# Altium project Põhiplaat.PrjPcb
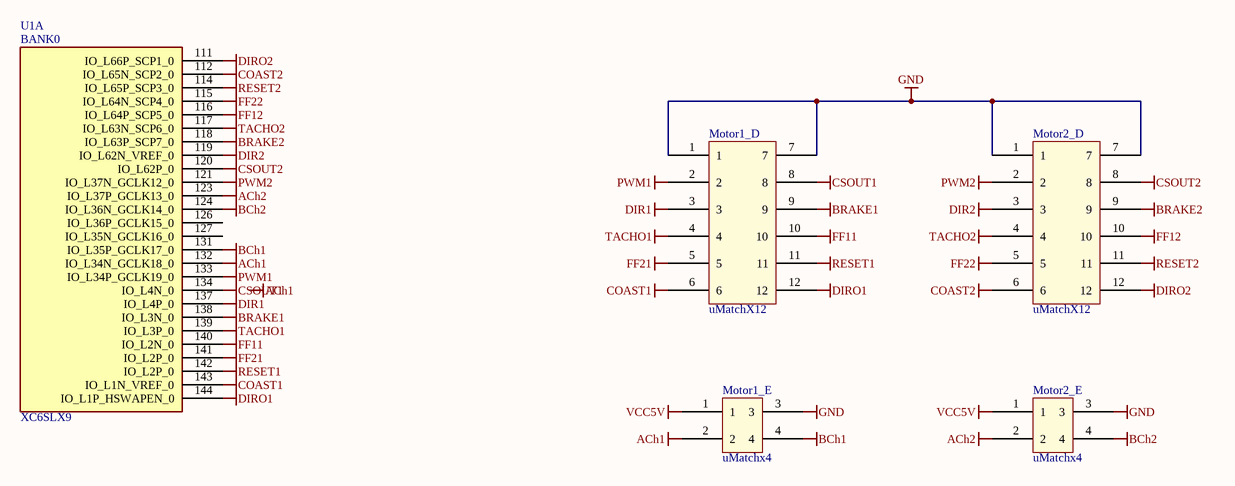
[diagram p0: BANK0.SchDoc]
5 sheets, 69 parts. Net scope: global (net labels, ports and power ports of the same name join across sheets).
Board file: Pohiplaat.PcbDoc
Sheets:
  BANK0.SchDoc
  BANK1.SchDoc
  BANK2.SchDoc
  BANK3.SchDoc
  Power.SchDoc

## Sheet BANK0.SchDoc
size A4

### Parts
Motor1_D  uMatchX12  [uMatchX12]
Motor1_E  uMatchx4  [Micromatch x4]
Motor2_D  uMatchX12  [uMatchX12]
Motor2_E  uMatchx4  [Micromatch x4]
U1  XC6SLX9  [XC6SLX9]  (part A of 6)

### Nets
ACh1: Motor1_E.2 U1.132(IO_L34N_GCLK18_0)
ACh2: Motor2_E.2 U1.123(IO_L37P_GCLK13_0)
BCh1: Motor1_E.4 U1.131(IO_L35P_GCLK17_0)
BCh2: Motor2_E.4 U1.124(IO_L36N_GCLK14_0)
BRAKE1: Motor1_D.9 U1.138(IO_L3N_0)
BRAKE2: Motor2_D.9 U1.118(IO_L63P_SCP7_0)
COAST1: Motor1_D.6 U1.143(IO_L1N_VREF_0)
COAST2: Motor2_D.6 U1.112(IO_L65N_SCP2_0)
CSOUT1: Motor1_D.8 U1.134(IO_L4N_0)
CSOUT2: Motor2_D.8 U1.120(IO_L62P_0)
DIR1: Motor1_D.3 U1.137(IO_L4P_0)
DIR2: Motor2_D.3 U1.119(IO_L62N_VREF_0)
DIRO1: Motor1_D.12 U1.144(IO_L1P_HSWAPEN_0)
DIRO2: Motor2_D.12 U1.111(IO_L66P_SCP1_0)
FF11: Motor1_D.10 U1.140(IO_L2N_0)
FF12: Motor2_D.10 U1.116(IO_L64P_SCP5_0)
FF21: Motor1_D.5 U1.141(IO_L2P_0)
FF22: Motor2_D.5 U1.115(IO_L64N_SCP4_0)
GND: Motor1_D.1 Motor1_D.7 Motor1_E.3 Motor2_D.1 Motor2_D.7 Motor2_E.3
PWM1: Motor1_D.2 U1.133(IO_L34P_GCLK19_0)
PWM2: Motor2_D.2 U1.121(IO_L37N_GCLK12_0)
RESET1: Motor1_D.11 U1.142(IO_L2P_0)
RESET2: Motor2_D.11 U1.114(IO_L65P_SCP3_0)
TACHO1: Motor1_D.4 U1.139(IO_L3P_0)
TACHO2: Motor2_D.4 U1.117(IO_L63N_SCP6_0)
VCC5V: Motor1_E.1 Motor2_E.1

Not connected (* = marked no-connect by the designer): U1 126(IO_L36P_GCLK15_0) 127(IO_L35N_GCLK16_0)

### Notes on the sheet
- Labels drawn without touching a wire or pin: ACh1
- (in symbol C6SLX9, part A) BANK0

### Library data of the parts
U1 = C6SLX9: Imported; Farnell: http://ee.farnell.com/xilinx/xc6slx9-2tqg144c/fpga-spartan-6-lx-9k-144tqfp/dp/1876228

## Sheet BANK1.SchDoc
size A4
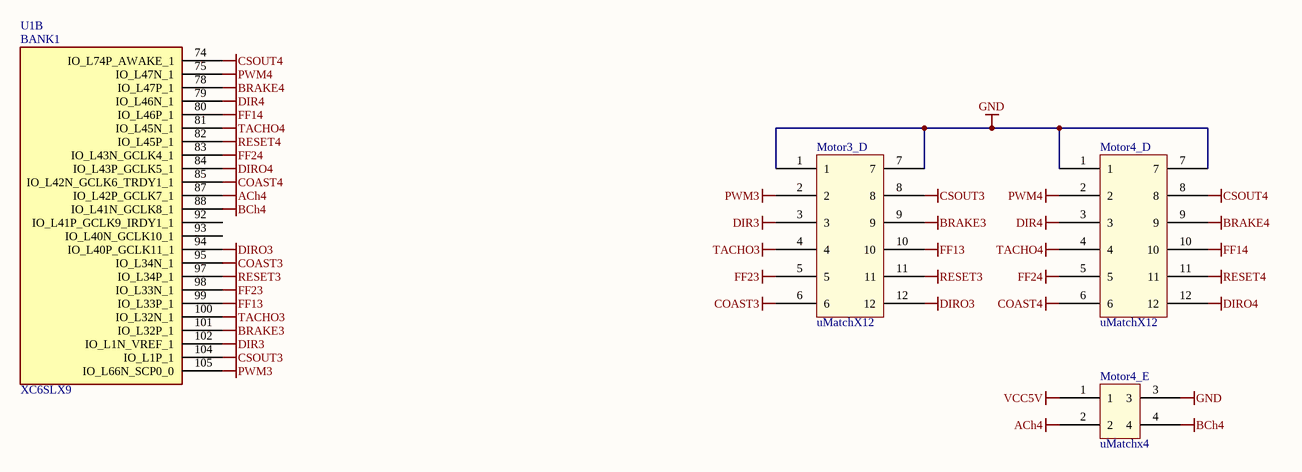
[diagram p1: BANK1.SchDoc]

### Parts
Motor3_D  uMatchX12  [uMatchX12]
Motor4_D  uMatchX12  [uMatchX12]
Motor4_E  uMatchx4  [Micromatch x4]
U1  XC6SLX9  [XC6SLX9]  (part B of 6)

### Nets
ACh4: Motor4_E.2 U1.87(IO_L42P_GCLK7_1)
BCh4: Motor4_E.4 U1.88(IO_L41N_GCLK8_1)
BRAKE3: Motor3_D.9 U1.101(IO_L32P_1)
BRAKE4: Motor4_D.9 U1.78(IO_L47P_1)
COAST3: Motor3_D.6 U1.95(IO_L34N_1)
COAST4: Motor4_D.6 U1.85(IO_L42N_GCLK6_TRDY1_1)
CSOUT3: Motor3_D.8 U1.104(IO_L1P_1)
CSOUT4: Motor4_D.8 U1.74(IO_L74P_AWAKE_1)
DIR3: Motor3_D.3 U1.102(IO_L1N_VREF_1)
DIR4: Motor4_D.3 U1.79(IO_L46N_1)
DIRO3: Motor3_D.12 U1.94(IO_L40P_GCLK11_1)
DIRO4: Motor4_D.12 U1.84(IO_L43P_GCLK5_1)
FF13: Motor3_D.10 U1.99(IO_L33P_1)
FF14: Motor4_D.10 U1.80(IO_L46P_1)
FF23: Motor3_D.5 U1.98(IO_L33N_1)
FF24: Motor4_D.5 U1.83(IO_L43N_GCLK4_1)
GND: Motor3_D.1 Motor3_D.7 Motor4_D.1 Motor4_D.7 Motor4_E.3
PWM3: Motor3_D.2 U1.105(IO_L66N_SCP0_0)
PWM4: Motor4_D.2 U1.75(IO_L47N_1)
RESET3: Motor3_D.11 U1.97(IO_L34P_1)
RESET4: Motor4_D.11 U1.82(IO_L45P_1)
TACHO3: Motor3_D.4 U1.100(IO_L32N_1)
TACHO4: Motor4_D.4 U1.81(IO_L45N_1)
VCC5V: Motor4_E.1

Not connected (* = marked no-connect by the designer): U1 92(IO_L41P_GCLK9_IRDY1_1) 93(IO_L40N_GCLK10_1)

### Notes on the sheet
- (in symbol C6SLX9, part B) BANK1

### Library data of the parts
U1 = C6SLX9: Imported

## Sheet BANK2.SchDoc
size A4
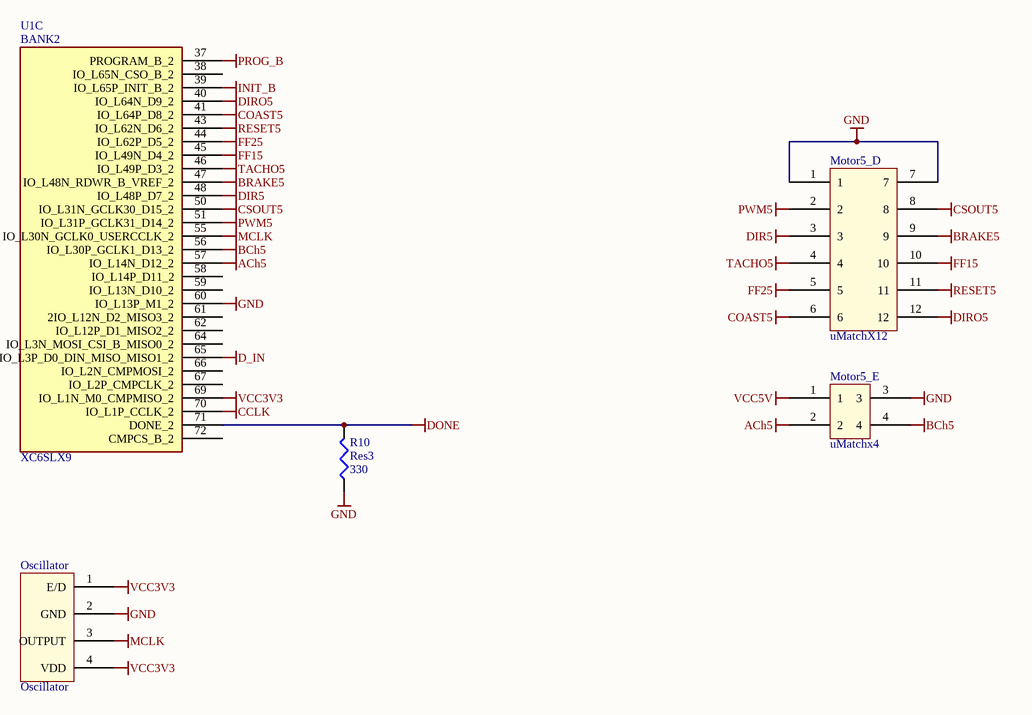
[diagram p2: BANK2.SchDoc]

### Parts
Motor5_D  uMatchX12  [uMatchX12]
Motor5_E  uMatchx4  [Micromatch x4]
Oscillator  Oscillator  [osc_FOOTPRINT]
R10  Res3  value 330  [J1-0603]
U1  XC6SLX9  [XC6SLX9]  (part C of 6)

### Nets
ACh5: Motor5_E.2 U1.57(IO_L14N_D12_2)
BCh5: Motor5_E.4 U1.56(IO_L30P_GCLK1_D13_2)
BRAKE5: Motor5_D.9 U1.47(IO_L48N_RDWR_B_VREF_2)
CCLK: U1.70(IO_L1P_CCLK_2)
COAST5: Motor5_D.6 U1.41(IO_L64P_D8_2)
CSOUT5: Motor5_D.8 U1.50(IO_L31N_GCLK30_D15_2)
D_IN: U1.65(IO_L3P_D0_DIN_MISO_MISO1_2)
DIR5: Motor5_D.3 U1.48(IO_L48P_D7_2)
DIRO5: Motor5_D.12 U1.40(IO_L64N_D9_2)
DONE: R10.2 U1.71(DONE_2)
FF15: Motor5_D.10 U1.45(IO_L49N_D4_2)
FF25: Motor5_D.5 U1.44(IO_L62P_D5_2)
GND: Motor5_D.1 Motor5_D.7 Motor5_E.3 Oscillator.2(GND) R10.1 U1.60(IO_L13P_M1_2)
INIT_B: U1.39(IO_L65P_INIT_B_2)
MCLK: Oscillator.3(OUTPUT) U1.55(IO_L30N_GCLK0_USERCCLK_2)
PROG_B: U1.37(PROGRAM_B_2)
PWM5: Motor5_D.2 U1.51(IO_L31P_GCLK31_D14_2)
RESET5: Motor5_D.11 U1.43(IO_L62N_D6_2)
TACHO5: Motor5_D.4 U1.46(IO_L49P_D3_2)
VCC3V3: Oscillator.1(E/D) Oscillator.4(VDD) U1.69(IO_L1N_M0_CMPMISO_2)
VCC5V: Motor5_E.1

Not connected (* = marked no-connect by the designer): U1 38(IO_L65N_CSO_B_2) 58(IO_L14P_D11_2) 59(IO_L13N_D10_2) 61(2IO_L12N_D2_MISO3_2) 62(IO_L12P_D1_MISO2_2) 64(IO_L3N_MOSI_CSI_B_MISO0_2) 66(IO_L2N_CMPMOSI_2) 67(IO_L2P_CMPCLK_2) 72(CMPCS_B_2)

### Notes on the sheet
- (in symbol C6SLX9, part C) BANK2

### Library data of the parts
Oscillator = Oscillator: Fox_osc_100MHz; Farnell: http://ee.farnell.com/fox-electronics/fxo-hc536r-33/osc-3-2x5mm-smd-cer-33-000mhz/dp/1641043?Ntt=1641043
R10 = Res3: Resistor; Published: 8-Jun-2000; LatestRevisionDate: 29-May-2009; LatestRevisionNote: IPC-7351 Footprint Added.; PackageReference: J1-0603; Publisher: Altium Limited; PackageDescription: Chip Resistor
U1 = C6SLX9: Imported; Farnell: http://ee.farnell.com/xilinx/xc6slx9-2tqg144c/fpga-spartan-6-lx-9k-144tqfp/dp/1876228

## Sheet BANK3.SchDoc
size A4
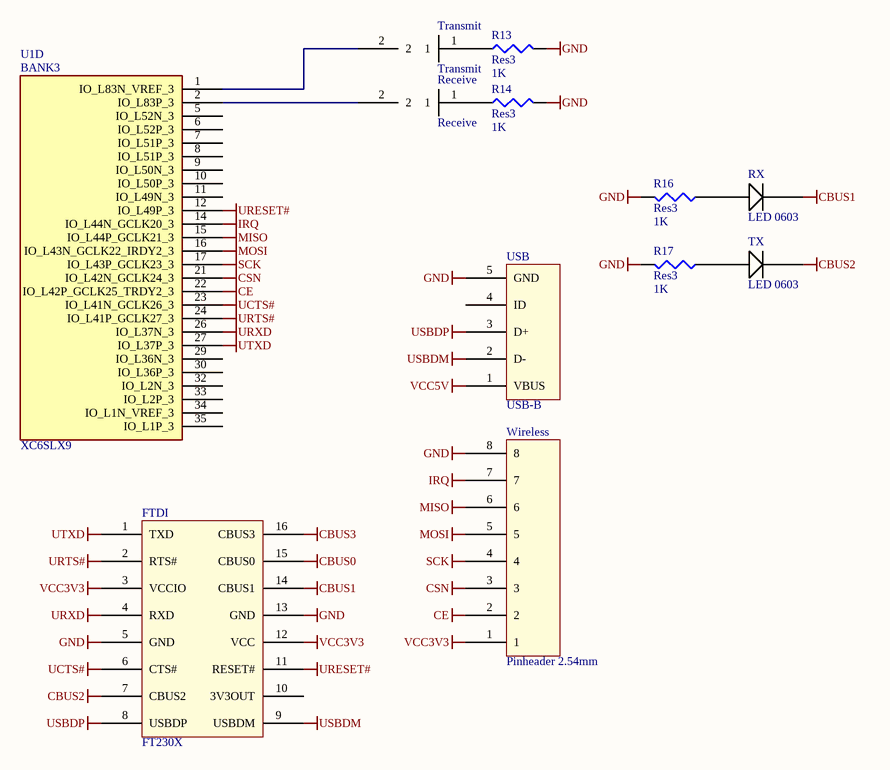
[diagram p3: BANK3.SchDoc]

### Parts
FTDI  FT230X  [FT230X]
R13  Res3  value 1K  [J1-0603]
R14  Res3  value 1K  [J1-0603]
R16  Res3  value 1K  [J1-0603]
R17  Res3  value 1K  [J1-0603]
Receive  Receive  [LED]
RX  LED 0603  [LED]
Transmit  Transmit  [LED]
TX  LED 0603  [LED]
U1  XC6SLX9  [XC6SLX9]  (part D of 6)
USB  USB-B  [USB-B mini]
Wireless  Pinheader 2.54mm  [Pinheader 2.54mm]

### Nets
CBUS0: FTDI.15(CBUS0)
CBUS1: FTDI.14(CBUS1) RX.2
CBUS2: FTDI.7(CBUS2) TX.2
CBUS3: FTDI.16(CBUS3)
CE: U1.22(IO_L42P_GCLK25_TRDY2_3) Wireless.2
CSN: U1.21(IO_L42N_GCLK24_3) Wireless.3
GND: FTDI.5(GND) FTDI.13(GND) R13.2 R14.2 R16.2 R17.2 USB.5(GND) Wireless.8
IRQ: U1.14(IO_L44N_GCLK20_3) Wireless.7
MISO: U1.15(IO_L44P_GCLK21_3) Wireless.6
MOSI: U1.16(IO_L43N_GCLK22_IRDY2_3) Wireless.5
SCK: U1.17(IO_L43P_GCLK23_3) Wireless.4
UCTS#: FTDI.6(CTS#) U1.23(IO_L41N_GCLK26_3)
URESET#: FTDI.11(RESET#) U1.12(IO_L49P_3)
URTS#: FTDI.2(RTS#) U1.24(IO_L41P_GCLK27_3)
URXD: FTDI.4(RXD) U1.26(IO_L37N_3)
USBDM: FTDI.9(USBDM) USB.2(D-)
USBDP: FTDI.8(USBDP) USB.3(D+)
UTXD: FTDI.1(TXD) U1.27(IO_L37P_3)
VCC3V3: FTDI.3(VCCIO) FTDI.12(VCC) Wireless.1
VCC5V: USB.1(VBUS)
NetR13_1: R13.1 Transmit.1
NetR14_1: R14.1 Receive.1
NetR16_1: R16.1 RX.1
NetR17_1: R17.1 TX.1
NetReceive_2: Receive.2 U1.2(IO_L83P_3)
NetTransmit_2: Transmit.2 U1.1(IO_L83N_VREF_3)

Not connected (* = marked no-connect by the designer): FTDI 10(3V3OUT); U1 5(IO_L52N_3) 6(IO_L52P_3) 7(IO_L51P_3) 8(IO_L51P_3) 9(IO_L50N_3) 10(IO_L50P_3) 11(IO_L49N_3) 29(IO_L36N_3) 30(IO_L36P_3) 32(IO_L2N_3) 33(IO_L2P_3) 34(IO_L1N_VREF_3) 35(IO_L1P_3); USB 4(ID)

### Notes on the sheet
- (in symbol C6SLX9, part D) BANK3

### Library data of the parts
R13 R14 R16 R17 = Res3: Resistor; Published: 8-Jun-2000; LatestRevisionDate: 29-May-2009; LatestRevisionNote: IPC-7351 Footprint Added.; PackageReference: J1-0603; Publisher: Altium Limited; PackageDescription: Chip Resistor
Receive Transmit = LED 0603
U1 = C6SLX9: Imported

## Sheet Power.SchDoc
size A3
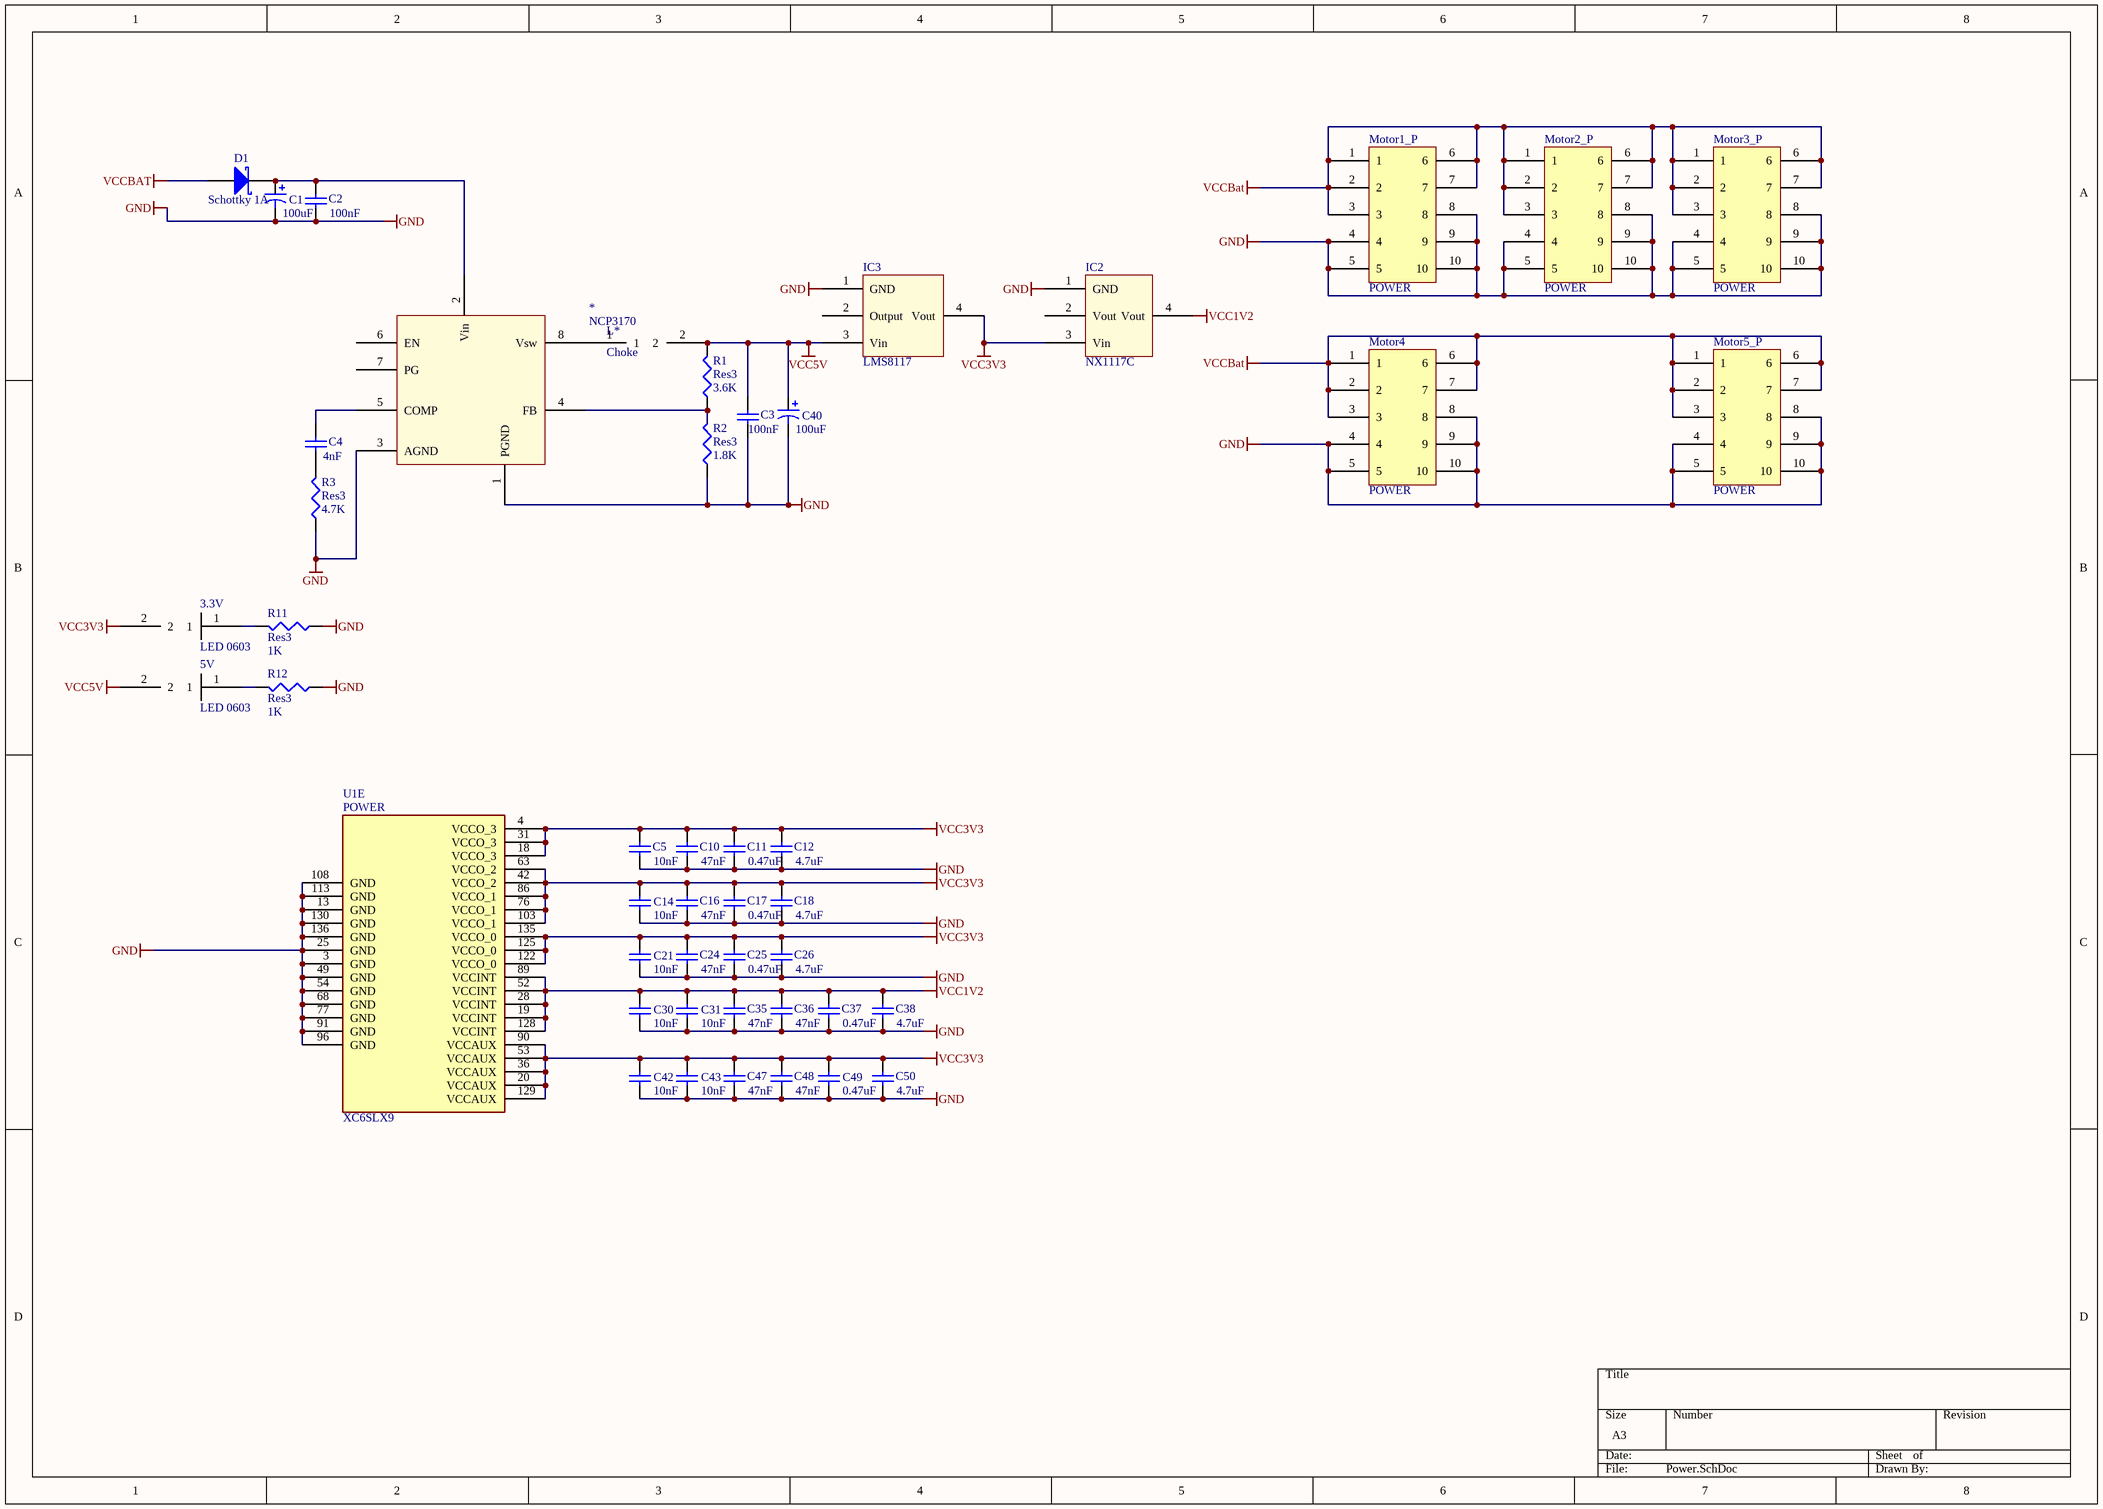
[diagram p4: Power.SchDoc]

### Parts
3.3V  LED 0603  [LED]
5V  LED 0603  [LED]
*  NCP3170  [NCP3170]
C1  value 100uF  [Capacitor]  (hidden comment: Cap Pol1)
C2  value 100nF  [1608[0603]]  (hidden comment: Cap Semi)
C3  value 100nF  [1608[0603]]  (hidden comment: Cap Semi)
C4  value 4nF  [1608[0603]]  (hidden comment: Cap Semi)
C5  value 10nF  [1608[0603]]  (hidden comment: Cap Semi)
C10  value 47nF  [1608[0603]]  (hidden comment: Cap Semi)
C11  value 0.47uF  [1608[0603]]  (hidden comment: Cap Semi)
C12  value 4.7uF  [1608[0603]]  (hidden comment: Cap Semi)
C14  value 10nF  [1608[0603]]  (hidden comment: Cap Semi)
C16  value 47nF  [1608[0603]]  (hidden comment: Cap Semi)
C17  value 0.47uF  [1608[0603]]  (hidden comment: Cap Semi)
C18  value 4.7uF  [1608[0603]]  (hidden comment: Cap Semi)
C21  value 10nF  [1608[0603]]  (hidden comment: Cap Semi)
C24  value 47nF  [1608[0603]]  (hidden comment: Cap Semi)
C25  value 0.47uF  [1608[0603]]  (hidden comment: Cap Semi)
C26  value 4.7uF  [1608[0603]]  (hidden comment: Cap Semi)
C30  value 10nF  [1608[0603]]  (hidden comment: Cap Semi)
C31  value 10nF  [1608[0603]]  (hidden comment: Cap Semi)
C35  value 47nF  [1608[0603]]  (hidden comment: Cap Semi)
C36  value 47nF  [1608[0603]]  (hidden comment: Cap Semi)
C37  value 0.47uF  [1608[0603]]  (hidden comment: Cap Semi)
C38  value 4.7uF  [1608[0603]]  (hidden comment: Cap Semi)
C40  value 100uF  [Capacitor]  (hidden comment: Cap Pol1)
C42  value 10nF  [1608[0603]]  (hidden comment: Cap Semi)
C43  value 10nF  [1608[0603]]  (hidden comment: Cap Semi)
C47  value 47nF  [1608[0603]]  (hidden comment: Cap Semi)
C48  value 47nF  [1608[0603]]  (hidden comment: Cap Semi)
C49  value 0.47uF  [1608[0603]]  (hidden comment: Cap Semi)
C50  value 4.7uF  [1608[0603]]  (hidden comment: Cap Semi)
D1  Schottky 1A  [SMB]
IC2  NX1117C  [NX1117C]
IC3  LMS8117  [LMS8117]
L*  Choke  [Choke]
Motor1_P  POWER  [uMatch10x]
Motor2_P  POWER  [uMatch10x]
Motor3_P  POWER  [uMatch10x]
Motor4  POWER  [uMatch10x]
Motor5_P  POWER  [uMatch10x]
R1  Res3  value 3.6K  [J1-0603]
R2  Res3  value 1.8K  [J1-0603]
R3  Res3  value 4.7K  [J1-0603]
R11  Res3  value 1K  [J1-0603]
R12  Res3  value 1K  [J1-0603]
U1  XC6SLX9  [XC6SLX9]  (part E of 6)

### Nets
GND: *.1(PGND) *.3(AGND) C1.2 C2.1 C3.1 C5.1 C10.1 C11.1 C12.1 C14.1 C16.1 C17.1 C18.1 C21.1 C24.1 C25.1 C26.1 C30.1 C31.1 C35.1 C36.1 C37.1 C38.1 C40.2 C42.1 C43.1 C47.1 C48.1 C49.1 C50.1 IC2.1(GND) IC3.1(GND) Motor1_P.4 Motor1_P.5 Motor1_P.8 Motor1_P.9 Motor1_P.10 Motor2_P.4 Motor2_P.5 Motor2_P.8 Motor2_P.9 Motor2_P.10 Motor3_P.4 Motor3_P.5 Motor3_P.8 Motor3_P.9 Motor3_P.10 Motor4.4 Motor4.5 Motor4.8 Motor4.9 Motor4.10 Motor5_P.4 Motor5_P.5 Motor5_P.8 Motor5_P.9 Motor5_P.10 R2.1 R3.1 R11.1 R12.1 U1.3(GND) U1.13(GND) U1.25(GND) U1.49(GND) U1.54(GND) U1.68(GND) U1.77(GND) U1.91(GND) U1.96(GND) U1.108(GND) U1.113(GND) U1.130(GND) U1.136(GND)
VCC1V2: C30.2 C31.2 C35.2 C36.2 C37.2 C38.2 IC2.4(Vout) U1.19(VCCINT) U1.28(VCCINT) U1.52(VCCINT) U1.89(VCCINT) U1.128(VCCINT)
VCC3V3: 3.3V.2 C5.2 C10.2 C11.2 C12.2 C14.2 C16.2 C17.2 C18.2 C21.2 C24.2 C25.2 C26.2 C42.2 C43.2 C47.2 C48.2 C49.2 C50.2 IC2.3(Vin) IC3.4(Vout) U1.4(VCCO_3) U1.18(VCCO_3) U1.20(VCCAUX) U1.31(VCCO_3) U1.36(VCCAUX) U1.42(VCCO_2) U1.53(VCCAUX) U1.63(VCCO_2) U1.76(VCCO_1) U1.86(VCCO_1) U1.90(VCCAUX) U1.103(VCCO_1) U1.122(VCCO_0) U1.125(VCCO_0) U1.129(VCCAUX) U1.135(VCCO_0)
VCC5V: 5V.2 C3.2 C40.1 IC3.3(Vin) L*.2 R1.2
VCCBat: D1.1(A) Motor1_P.1 Motor1_P.2 Motor1_P.3 Motor1_P.6 Motor1_P.7 Motor2_P.1 Motor2_P.2 Motor2_P.3 Motor2_P.6 Motor2_P.7 Motor3_P.1 Motor3_P.2 Motor3_P.3 Motor3_P.6 Motor3_P.7 Motor4.1 Motor4.2 Motor4.3 Motor4.6 Motor4.7 Motor5_P.1 Motor5_P.2 Motor5_P.3 Motor5_P.6 Motor5_P.7
Net3.3V_1: 3.3V.1 R11.2
Net5V_1: 5V.1 R12.2
Net*_2: *.2(Vin) C1.1 C2.2 D1.2(K)
Net*_4: *.4(FB) R1.1 R2.2
Net*_5: *.5(COMP) C4.2
Net*_8: *.8(Vsw) L*.1
NetC4_1: C4.1 R3.2

Not connected (* = marked no-connect by the designer): * 6(EN) 7(PG); IC2 2(Vout); IC3 2(Output)

### Notes on the sheet
- (in symbol C6SLX9, part E) POWER

### Library data of the parts
C1 C40 = Cap Pol1: Polarized Capacitor (Radial); Published: 8-Jun-2000; LatestRevisionDate: 17-Jul-2002; LatestRevisionNote: Re-released for DXP Platform.; PackageReference: RB7.6-15; Publisher: Altium Limited; PackageDescription: Polarized Capacitor (Radial); 2 Leads; Farnell: http://ee.farnell.com/multicomp/mcgpr35v107m8x11/cap-alu-elect-100uf-35v-can/dp/9451285
C2-C5 C10-C12 C14 C16-C18 C21 C24-C26 C30 C31 C35-C38 C42 C43 C47-C50 = Cap Semi: Capacitor (Semiconductor SIM Model); Published: 8-Jun-2000; LatestRevisionDate: 29-May-2009; LatestRevisionNote: IPC-7351 Footprint Added.; PackageReference: C1206; Publisher: Altium Limited; PackageDescription: Chip Capacitor
D1 = D Schottky: Schottky Diode; Published: 8-Jun-2000; LatestRevisionDate: 17-Jul-2002; LatestRevisionNote: Re-released for DXP Platform.; PackageReference: SMB; Publisher: Altium Limited; PackageDescription: DO-214-AA/SMB; 2 C-Bend Leads; Body 5.3 x 3.6 mm, inc. leads (LxW); Code_JEDEC: DO-214-AA; Farnell: http://ee.farnell.com/multicomp/ss110b/diode-schottky-rectif-1a-100v-smb/dp/1861422
Motor1_P Motor2_P Motor3_P Motor4 Motor5_P = uMatch 10x
R1-R3 R11 R12 = Res3: Resistor; Published: 8-Jun-2000; LatestRevisionDate: 29-May-2009; LatestRevisionNote: IPC-7351 Footprint Added.; PackageReference: J1-0603; Publisher: Altium Limited; PackageDescription: Chip Resistor
U1 = C6SLX9: Imported
L* = Choke: Farnell: http://ee.farnell.com/wurth-elektronik/7440700047/choke-smd-4-7uh-3a/dp/1635879?Ntt=1635879

## Nets that join several sheets
GND: BANK0 (6 pins), BANK1 (5 pins), BANK2 (6 pins), BANK3 (8 pins), Power (74 pins)
VCC3V3: BANK2 (Oscillator.1 Oscillator.4 U1.69), BANK3 (FTDI.3 FTDI.12 Wireless.1), Power (37 pins)
VCC5V: BANK0 (Motor1_E.1 Motor2_E.1), BANK1 (Motor4_E.1), BANK2 (Motor5_E.1), BANK3 (USB.1), Power (6 pins)